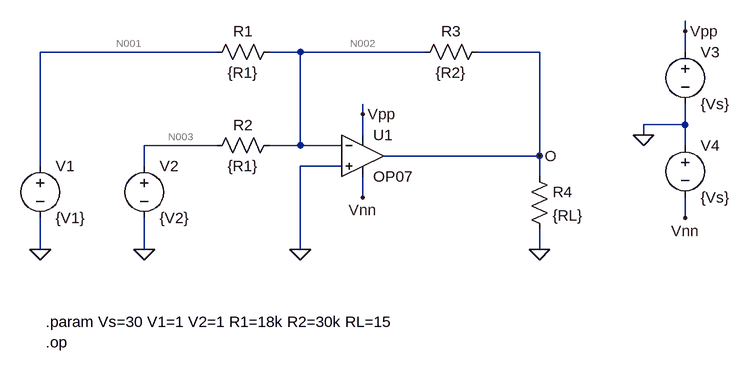
[diagram p0: schematic Q3.asc]
Q3.asc, the LTspice schematic file:
Version 4.1
SHEET 1 1012 680
WIRE 928 -160 928 -176
WIRE 208 -128 -64 -128
WIRE 336 -128 288 -128
WIRE 528 -128 336 -128
WIRE 704 -128 608 -128
WIRE 928 -128 928 -160
WIRE 432 -32 432 -48
WIRE 928 -16 928 -48
WIRE 928 -16 864 -16
WIRE 432 0 432 -32
WIRE 864 0 864 -16
WIRE 208 16 96 16
WIRE 336 16 336 -128
WIRE 336 16 288 16
WIRE 400 16 336 16
WIRE 928 16 928 -16
WIRE 704 32 704 -128
WIRE 704 32 464 32
WIRE -64 48 -64 -128
WIRE 96 48 96 16
WIRE 400 48 336 48
WIRE 704 64 704 32
WIRE 432 96 432 64
WIRE 928 128 928 96
WIRE -64 176 -64 128
WIRE 96 176 96 128
WIRE 336 176 336 48
WIRE 704 176 704 144
FLAG -64 176 0
FLAG 96 176 0
FLAG 336 176 0
FLAG 432 -32 Vpp
FLAG 432 96 Vnn
FLAG 704 176 0
FLAG 864 0 0
FLAG 704 32 O
FLAG 928 128 Vnn
FLAG 928 -160 Vpp
SYMBOL voltage -64 32 R0
WINDOW 123 0 0 Left 0
WINDOW 39 0 0 Left 0
SYMATTR InstName V1
SYMATTR Value {V1}
SYMBOL voltage 96 32 R0
SYMATTR InstName V2
SYMATTR Value {V2}
SYMBOL res 304 -144 R90
WINDOW 0 0 56 VBottom 2
WINDOW 3 32 56 VTop 2
SYMATTR InstName R1
SYMATTR Value {R1}
SYMBOL res 304 0 R90
WINDOW 0 0 56 VBottom 2
WINDOW 3 32 56 VTop 2
SYMATTR InstName R2
SYMATTR Value {R1}
SYMBOL OpAmps\\OP07 432 -32 R0
SYMATTR InstName U1
SYMBOL res 624 -144 R90
WINDOW 0 0 56 VBottom 2
WINDOW 3 32 56 VTop 2
SYMATTR InstName R3
SYMATTR Value {R2}
SYMBOL res 688 48 R0
SYMATTR InstName R4
SYMATTR Value {RL}
SYMBOL voltage 928 -144 R0
SYMATTR InstName V3
SYMATTR Value {Vs}
SYMBOL voltage 928 0 R0
SYMATTR InstName V4
SYMATTR Value {Vs}
TEXT -56 288 Left 2 !.param Vs=30 V1=1 V2=1 R1=18k R2=30k RL=15\n.op

The netlist it stands for:
* Q3.asc
V1 N001 0 {V1}
V2 N003 0 {V2}
R1 N002 N001 {R1}
R2 N002 N003 {R1}
X§U1 0 N002 Vpp Vnn O LT1001  ; OP07, pins In+ In- V+ V- OUT
R3 O N002 {R2}
R4 O 0 {RL}
V3 Vpp 0 {Vs}
V4 0 Vnn {Vs}
.param Vs=30 V1=1 V2=1 R1=18k R2=30k RL=15
.op
.lib LTC.lib
.backanno
.end

* Results of the author's LTspice run, read from the files saved beside the schematic
* Operating Point:
*   V(n003) = 1 V
*   V(vpp) = 30 V
*   V(vnn) = -30 V
*   V(n001) = 1 V
*   V(n002) = 636.2 mV
*   V(o) = -576.1 mV
*   I(V1) = -20.21 µA
*   I(R4) = -38.41 mA
*   I(R1) = -20.21 µA
*   I(V3) = -3.266 nA
*   I(R2) = -20.21 µA
*   I(R3) = -40.41 µA
*   I(V2) = -20.21 µA
*   I(V4) = -38.44 mA
*   Ix(u1:1) = -8.589 nA
*   Ix(u1:2) = 8.59 nA
*   Ix(u1:3) = 3.235 nA
*   Ix(u1:4) = -38.44 mA
*   Ix(u1:5) = 38.45 mA